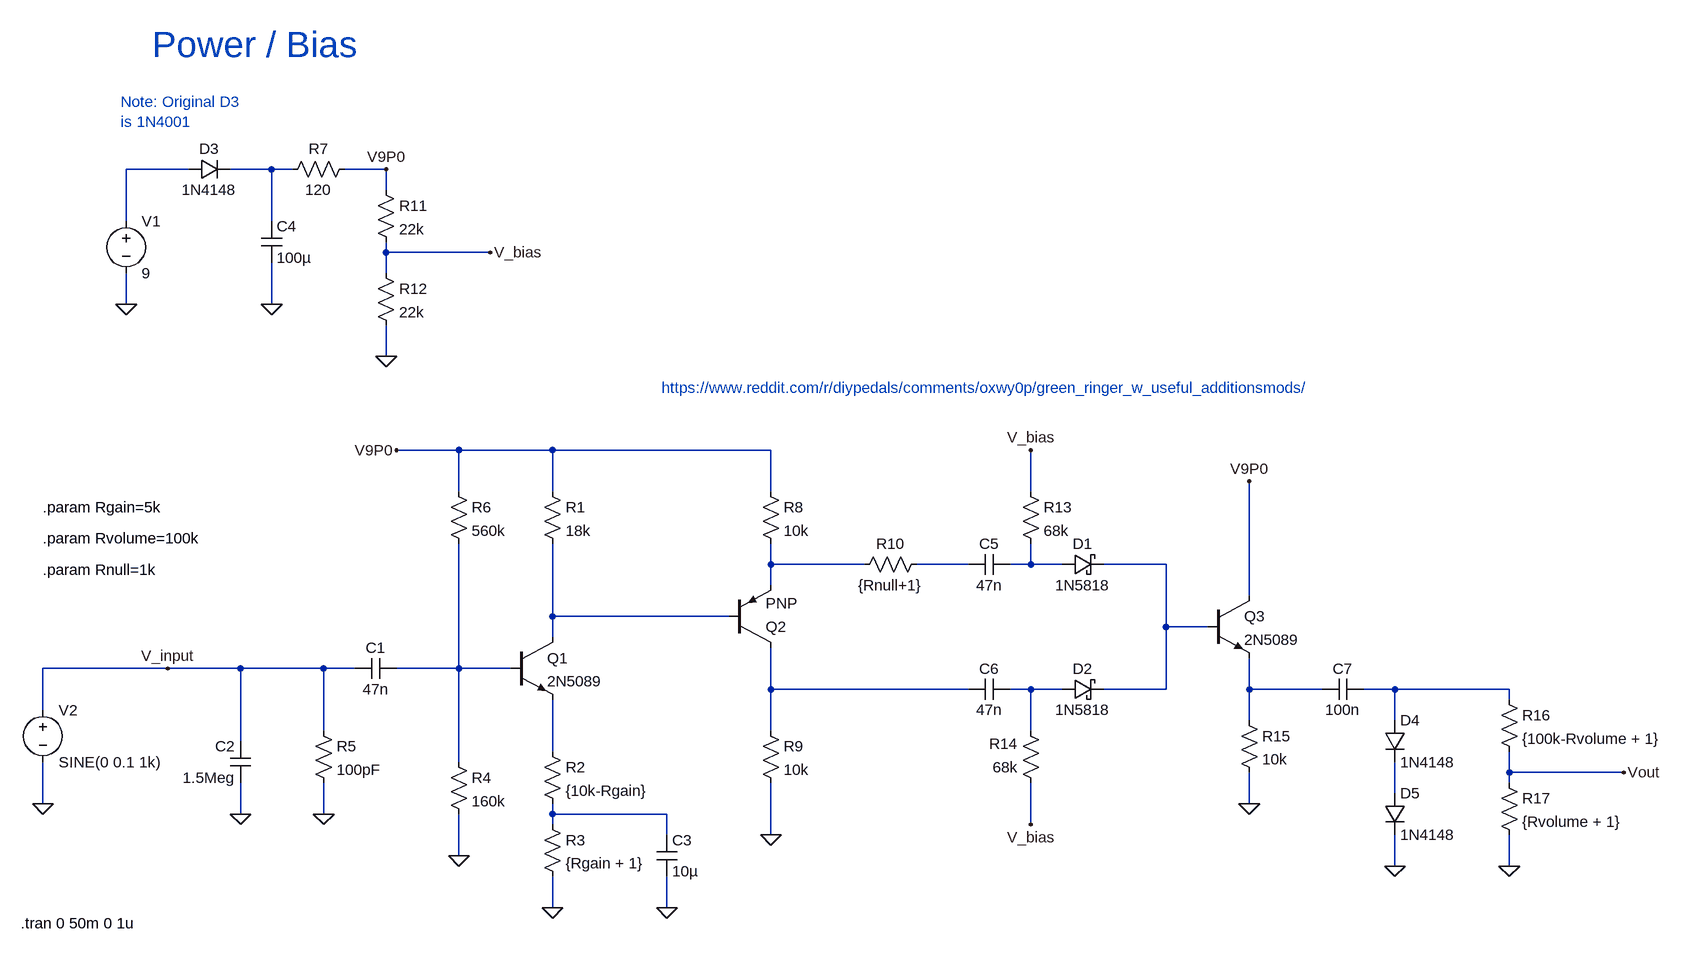
[diagram p0: schematic dan-armstrong-green-ringer.asc]
dan-armstrong-green-ringer.asc, the LTspice schematic file:
Version 4
SHEET 1 2028 776
WIRE -272 -400 -368 -400
WIRE -144 -400 -208 -400
WIRE -112 -400 -144 -400
WIRE 32 -400 -32 -400
WIRE 32 -368 32 -400
WIRE -368 -320 -368 -400
WIRE -144 -320 -144 -400
WIRE 32 -272 32 -288
WIRE 192 -272 32 -272
WIRE 32 -240 32 -272
WIRE -368 -192 -368 -240
WIRE -144 -192 -144 -256
WIRE 32 -112 32 -160
WIRE 144 32 48 32
WIRE 288 32 144 32
WIRE 624 32 288 32
WIRE 144 96 144 32
WIRE 288 96 288 32
WIRE 624 96 624 32
WIRE 1024 96 1024 32
WIRE 624 208 624 176
WIRE 768 208 624 208
WIRE 928 208 848 208
WIRE 1024 208 1024 176
WIRE 1024 208 992 208
WIRE 1072 208 1024 208
WIRE 1232 208 1136 208
WIRE 624 240 624 208
WIRE 1360 256 1360 80
WIRE 288 288 288 176
WIRE 560 288 288 288
WIRE 1232 304 1232 208
WIRE 1296 304 1232 304
WIRE 288 320 288 288
WIRE -304 368 -496 368
WIRE -192 368 -304 368
WIRE -64 368 -192 368
WIRE -16 368 -64 368
WIRE 144 368 144 176
WIRE 144 368 48 368
WIRE 224 368 144 368
WIRE 624 400 624 336
WIRE 928 400 624 400
WIRE 1024 400 992 400
WIRE 1072 400 1024 400
WIRE 1232 400 1232 304
WIRE 1232 400 1136 400
WIRE 1360 400 1360 352
WIRE 1472 400 1360 400
WIRE 1584 400 1536 400
WIRE 1760 400 1584 400
WIRE 1760 416 1760 400
WIRE -496 432 -496 368
WIRE 1360 448 1360 400
WIRE 1584 448 1584 400
WIRE -64 464 -64 368
WIRE 624 464 624 400
WIRE 1024 464 1024 400
WIRE -192 480 -192 368
WIRE 288 496 288 416
WIRE 144 512 144 368
WIRE 1760 528 1760 496
WIRE 1936 528 1760 528
WIRE 1760 544 1760 528
WIRE 1584 560 1584 512
WIRE -496 576 -496 512
WIRE 1360 576 1360 528
WIRE -192 592 -192 544
WIRE -64 592 -64 544
WIRE 288 592 288 576
WIRE 464 592 288 592
WIRE 288 608 288 592
WIRE 1024 608 1024 544
WIRE 464 624 464 592
WIRE 624 624 624 544
WIRE 144 656 144 592
WIRE 1584 672 1584 624
WIRE 1760 672 1760 624
WIRE 288 736 288 688
WIRE 464 736 464 688
FLAG -64 592 0
FLAG -192 592 0
FLAG 144 656 0
FLAG 288 736 0
FLAG 464 736 0
FLAG 624 624 0
FLAG -144 -192 0
FLAG -304 368 V_input
FLAG -368 -192 0
FLAG 32 -112 0
FLAG 32 -400 V9P0
FLAG 192 -272 V_bias
FLAG 48 32 V9P0
FLAG 1024 32 V_bias
FLAG 1024 608 V_bias
FLAG 1360 576 0
FLAG 1360 80 V9P0
FLAG 1584 672 0
FLAG 1760 672 0
FLAG 1936 528 Vout
FLAG -496 576 0
SYMBOL npn 224 320 R0
SYMATTR InstName Q1
SYMATTR Value 2N5089
SYMBOL pnp 560 336 M180
SYMATTR InstName Q2
SYMBOL res 272 80 R0
SYMATTR InstName R1
SYMATTR Value 18k
SYMBOL res 272 480 R0
SYMATTR InstName R2
SYMATTR Value {10k-Rgain}
SYMBOL res 272 592 R0
SYMATTR InstName R3
SYMATTR Value {Rgain + 1}
SYMBOL res 128 496 R0
SYMATTR InstName R4
SYMATTR Value 160k
SYMBOL cap 48 352 R90
WINDOW 0 0 32 VBottom 2
WINDOW 3 32 32 VTop 2
SYMATTR InstName C1
SYMATTR Value 47n
SYMBOL res -80 448 R0
SYMATTR InstName R5
SYMATTR Value 100pF
SYMBOL cap -176 544 R180
WINDOW 0 24 56 Left 2
WINDOW 3 24 8 Left 2
SYMATTR InstName C2
SYMATTR Value 1.5Meg
SYMBOL res 128 80 R0
SYMATTR InstName R6
SYMATTR Value 560k
SYMBOL res -16 -416 R90
WINDOW 0 0 56 VBottom 2
WINDOW 3 32 56 VTop 2
SYMATTR InstName R7
SYMATTR Value 120
SYMBOL res 608 80 R0
SYMATTR InstName R8
SYMATTR Value 10k
SYMBOL cap 448 624 R0
SYMATTR InstName C3
SYMATTR Value 10µ
SYMBOL res 608 448 R0
SYMATTR InstName R9
SYMATTR Value 10k
SYMBOL cap -160 -320 R0
SYMATTR InstName C4
SYMATTR Value 100µ
SYMBOL res 864 192 R90
WINDOW 0 0 56 VBottom 2
WINDOW 3 32 56 VTop 2
SYMATTR InstName R10
SYMATTR Value {Rnull+1}
SYMBOL cap 992 192 R90
WINDOW 0 0 32 VBottom 2
WINDOW 3 32 32 VTop 2
SYMATTR InstName C5
SYMATTR Value 47n
SYMBOL cap 992 384 R90
WINDOW 0 0 32 VBottom 2
WINDOW 3 32 32 VTop 2
SYMATTR InstName C6
SYMATTR Value 47n
SYMBOL schottky 1072 224 R270
WINDOW 0 32 32 VTop 2
WINDOW 3 0 32 VBottom 2
SYMATTR InstName D1
SYMATTR Value 1N5818
SYMATTR Description Diode
SYMATTR Type diode
SYMBOL schottky 1072 416 R270
WINDOW 0 32 32 VTop 2
WINDOW 3 0 32 VBottom 2
SYMATTR InstName D2
SYMATTR Value 1N5818
SYMATTR Description Diode
SYMATTR Type diode
SYMBOL npn 1296 256 R0
SYMATTR InstName Q3
SYMATTR Value 2N5089
SYMBOL voltage -368 -336 R0
WINDOW 123 0 0 Left 0
WINDOW 39 0 0 Left 0
SYMATTR InstName V1
SYMATTR Value 9
SYMBOL diode -272 -384 R270
WINDOW 0 32 32 VTop 2
WINDOW 3 0 32 VBottom 2
SYMATTR InstName D3
SYMATTR Value 1N4148
SYMBOL res 16 -384 R0
SYMATTR InstName R11
SYMATTR Value 22k
SYMBOL res 16 -256 R0
SYMATTR InstName R12
SYMATTR Value 22k
SYMBOL res 1008 80 R0
SYMATTR InstName R13
SYMATTR Value 68k
SYMBOL res 1040 560 R180
WINDOW 0 36 76 Left 2
WINDOW 3 36 40 Left 2
SYMATTR InstName R14
SYMATTR Value 68k
SYMBOL res 1344 432 R0
SYMATTR InstName R15
SYMATTR Value 10k
SYMBOL cap 1536 384 R90
WINDOW 0 0 32 VBottom 2
WINDOW 3 32 32 VTop 2
SYMATTR InstName C7
SYMATTR Value 100n
SYMBOL diode 1568 448 R0
SYMATTR InstName D4
SYMATTR Value 1N4148
SYMBOL diode 1568 560 R0
SYMATTR InstName D5
SYMATTR Value 1N4148
SYMBOL res 1744 400 R0
SYMATTR InstName R16
SYMATTR Value {100k-Rvolume + 1}
SYMBOL res 1744 528 R0
SYMATTR InstName R17
SYMATTR Value {Rvolume + 1}
SYMBOL voltage -496 416 R0
WINDOW 123 24 124 Left 2
WINDOW 39 0 0 Left 0
SYMATTR InstName V2
SYMATTR Value SINE(0 0.1 1k)
TEXT 456 -64 Left 2 ;https://www.reddit.com/r/diypedals/comments/oxwy0p/green_ringer_w_useful_additionsmods/
TEXT -376 -504 Left 2 ;Note: Original D3 \nis 1N4001
TEXT -328 -592 Left 5 ;Power / Bias
TEXT -530 760 Left 2 !.tran 0 50m 0 1u
TEXT -496 120 Left 2 !.param Rgain=5k
TEXT -496 168 Left 2 !.param Rvolume=100k
TEXT -496 216 Left 2 !.param Rnull=1k

The netlist it stands for:
* dan-armstrong-green-ringer.asc
Q1 N007 N008 N013 0 2N5089
Q2 N009 N007 N003 0 PNP
R1 V9P0 N007 18k
R2 N013 N015 {10k-Rgain}
R3 N015 0 {Rgain + 1}
R4 N008 0 160k
C1 N008 V_input 47n
R5 V_input 0 100pF
C2 0 V_input 1.5Meg
R6 V9P0 N008 560k
R7 V9P0 N002 120
R8 V9P0 N003 10k
C3 N015 0 10µ
R9 N009 0 10k
C4 N002 0 100µ
R10 N004 N003 {Rnull+1}
C5 N005 N004 47n
C6 N010 N009 47n
D1 N005 N006 1N5818
D2 N010 N006 1N5818
Q3 V9P0 N006 N011 0 2N5089
V1 N001 0 9
D3 N001 N002 1N4148
R11 V9P0 V_bias 22k
R12 V_bias 0 22k
R13 V_bias N005 68k
R14 V_bias N010 68k
R15 N011 0 10k
C7 N012 N011 100n
D4 N012 N014 1N4148
D5 N014 0 1N4148
R16 N012 Vout {100k-Rvolume + 1}
R17 Vout 0 {Rvolume + 1}
V2 V_input 0 SINE(0 0.1 1k)
.model D D
.lib standard.dio
.model NPN NPN
.model PNP PNP
.lib standard.bjt
* https://www.reddit.com/r/diypedals/comments/oxwy0p/green_ringer_w_useful_additionsmods/
* Note: Original D3
* is 1N4001
* Power / Bias
.tran 0 50m 0 1u
.param Rgain=5k
.param Rvolume=100k
.param Rnull=1k
.backanno
.end